# Altium schematic sheet MCU.SchDoc
size A3; SheetNumber: 2; SheetTotal: 3
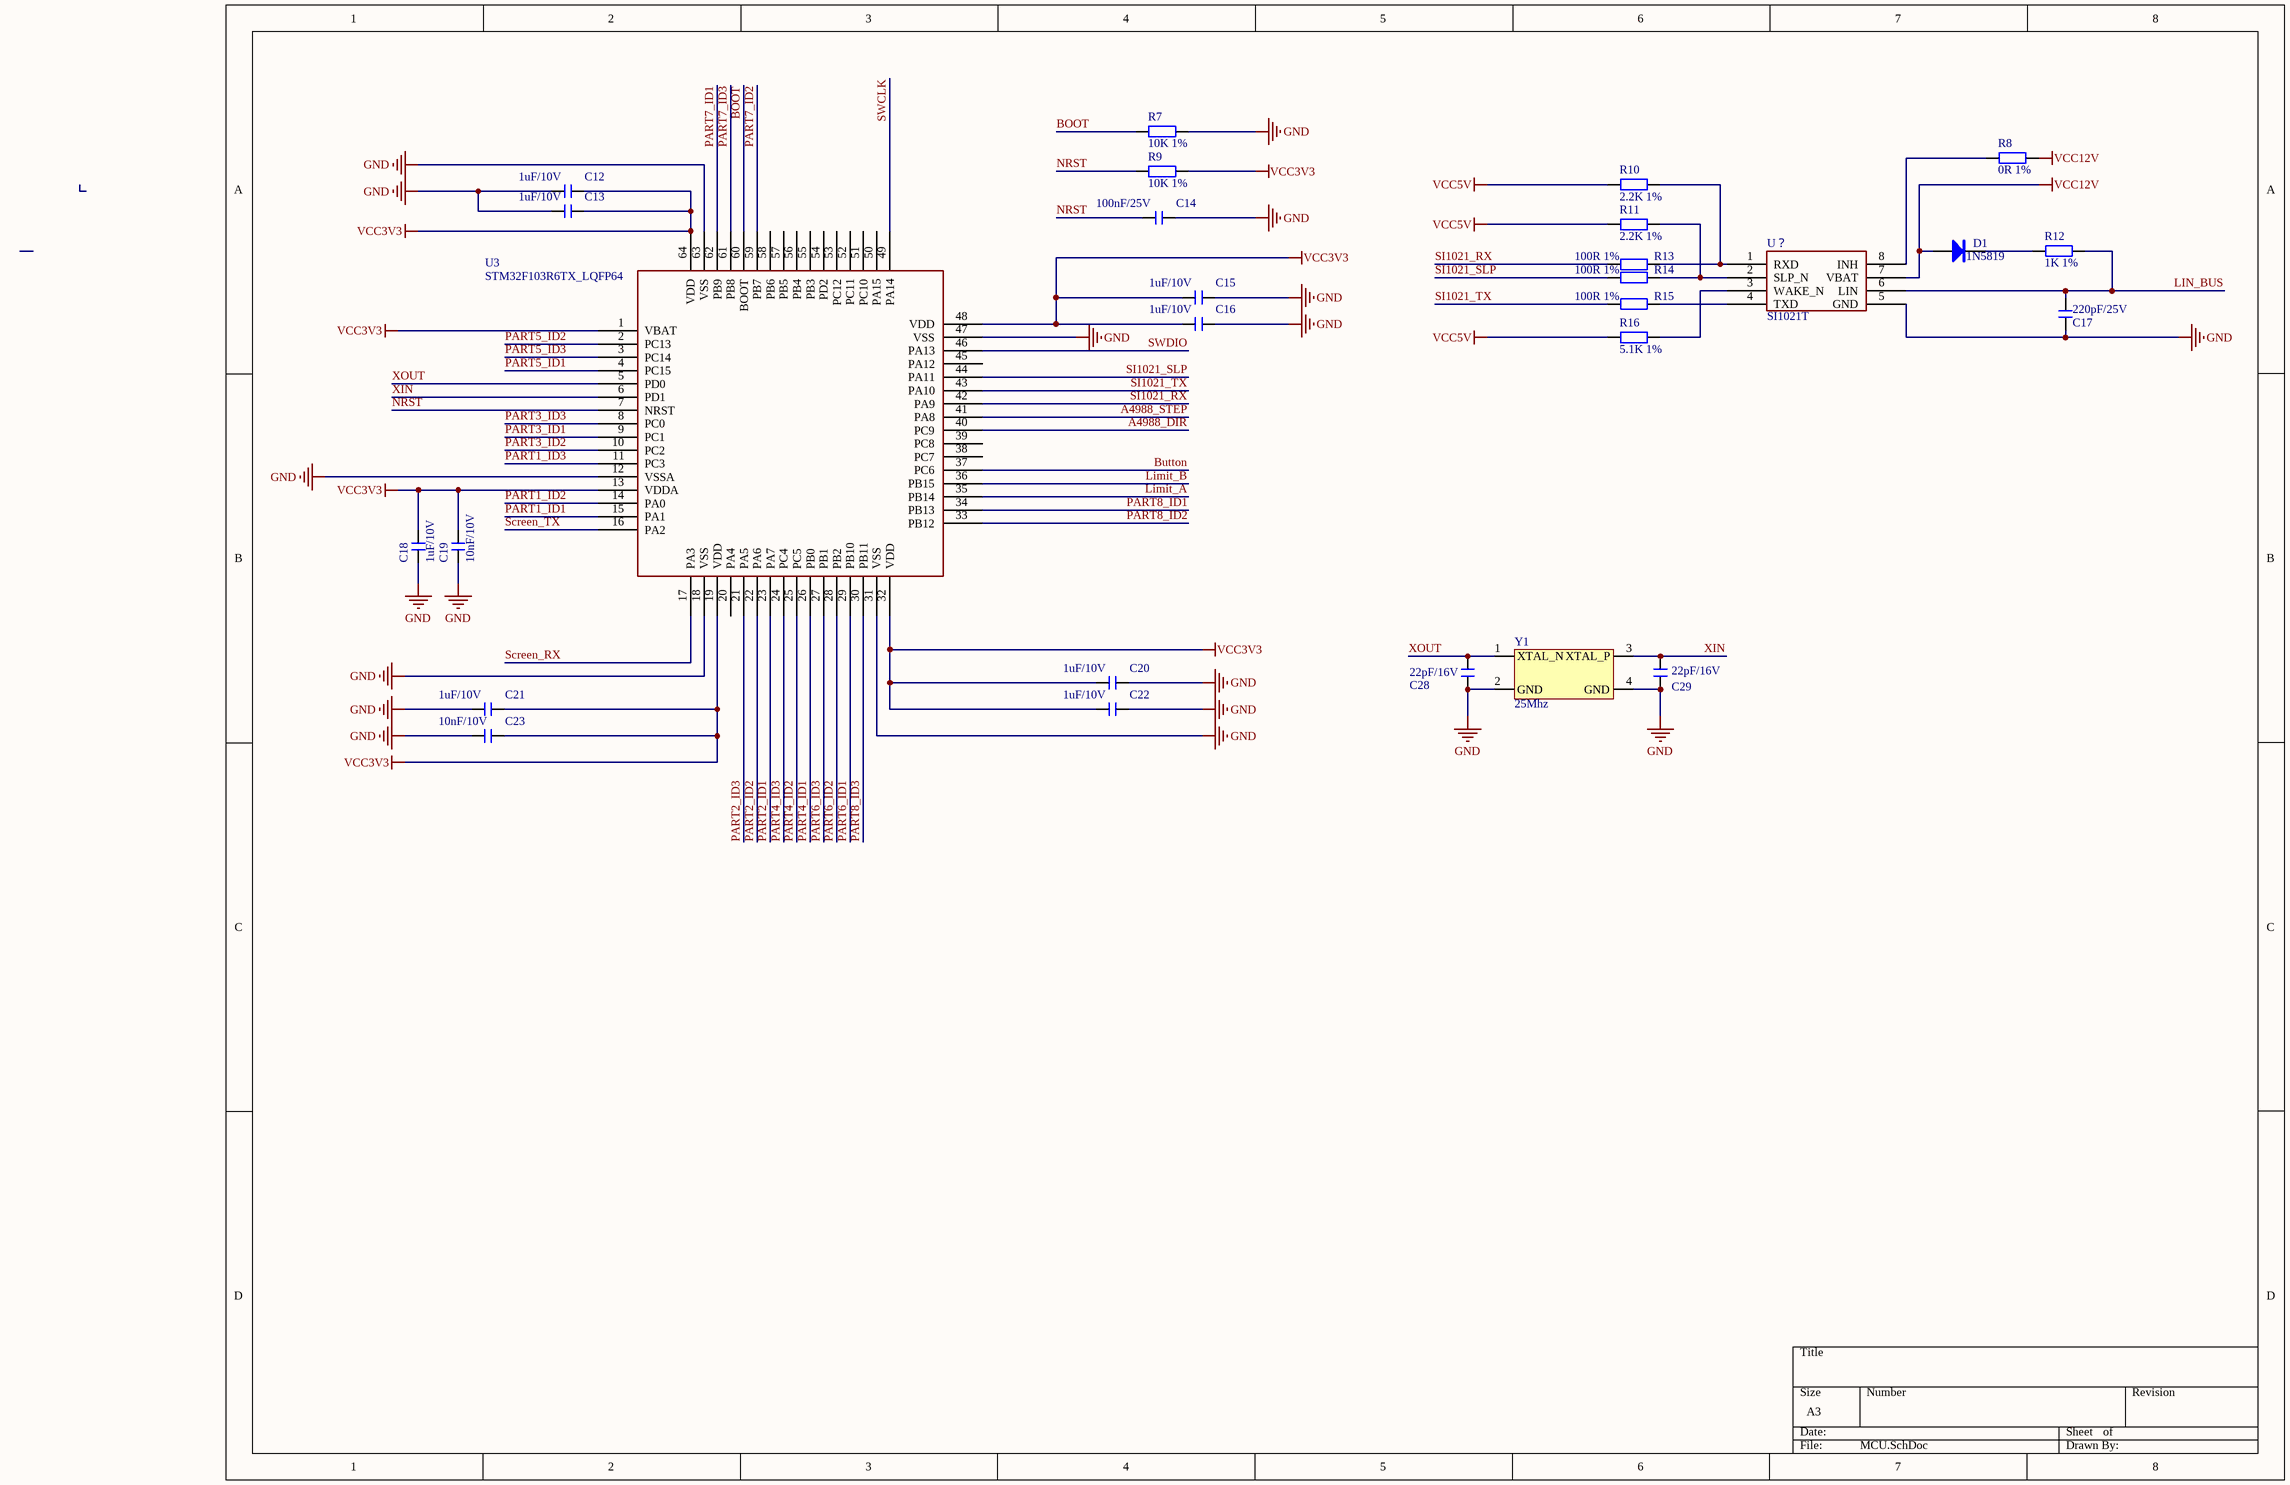
[diagram p0: MCU.SchDoc]

## Parts
C12  1uF/10V  [C0603_L]
C13  1uF/10V  [C0603_L]
C14  100nF/25V  [C0603_L]
C15  1uF/10V  [C0603_L]
C16  1uF/10V  [C0603_L]
C17  220pF/25V  [C0603_L]
C18  1uF/10V  [C0603_L]
C19  10nF/10V  [C0603_L]
C20  1uF/10V  [C0603_L]
C21  1uF/10V  [C0603_L]
C22  1uF/10V  [C0603_L]
C23  10nF/10V  [C0603_L]
C28  22pF/16V  [C0402_L]
C29  22pF/16V  [C0402_L]
D1  1N5819  [SOD-323]
R7  10K 1%  [R0603_L]
R8  0R 1%  [R0603_L]
R9  10K 1%  [R0603_L]
R10  2.2K 1%  [R0603_L]
R11  2.2K 1%  [R0603_L]
R12  1K 1%  [R0603_L]
R13  100R 1%  [R0603_L]
R14  100R 1%  [R0603_L]
R15  100R 1%  [R0603_L]
R16  5.1K 1%  [R0603_L]
U3  STM32F103R6TX_LQFP64  [LQFP64 10x10_N]
U？  SI1021T  [SOP8]
Y1  25Mhz  [OSC 3225-4P]

## Nets
GND: C12.2 C13.2 C14.1 C15.1 C16.1 C17.1 C18.1 C19.1 C20.1 C21.2 C22.1 C23.2 C28.2 C29.2 R7.2 U3.12(VSSA) U3.18(VSS) U3.31(VSS) U3.47(VSS) U3.63(VSS) U？.5(GND) Y1.2(GND) Y1.4(GND)
VCC3V3: C12.1 C13.1 C15.2 C16.2 C18.2 C19.2 C20.2 C21.1 C22.2 C23.1 R9.2 U3.1(VBAT) U3.13(VDDA) U3.19(VDD) U3.32(VDD) U3.48(VDD) U3.64(VDD)
VCC5V: R10.2 R11.2 R16.2
VCC12V: D1.1(A) R8.1 U？.7(VBAT)
A4988_DIR: U3.40(PC9)
A4988_STEP: U3.41(PA8)
BOOT: R7.1 U3.60(BOOT)
Button: U3.37(PC6)
Limit_A: U3.35(PB14)
Limit_B: U3.36(PB15)
LIN_BUS: C17.2 R12.1 U？.6(LIN)
NRST: C14.2 R9.1 U3.7(NRST)
PART1_ID1: U3.15(PA1)
PART1_ID2: U3.14(PA0)
PART1_ID3: U3.11(PC3)
PART2_ID1: U3.23(PA7)
PART2_ID2: U3.22(PA6)
PART2_ID3: U3.21(PA5)
PART3_ID1: U3.9(PC1)
PART3_ID2: U3.10(PC2)
PART3_ID3: U3.8(PC0)
PART4_ID1: U3.26(PB0)
PART4_ID2: U3.25(PC5)
PART4_ID3: U3.24(PC4)
PART5_ID1: U3.4(PC15)
PART5_ID2: U3.2(PC13)
PART5_ID3: U3.3(PC14)
PART6_ID1: U3.29(PB10)
PART6_ID2: U3.28(PB2)
PART6_ID3: U3.27(PB1)
PART7_ID1: U3.62(PB9)
PART7_ID2: U3.59(PB7)
PART7_ID3: U3.61(PB8)
PART8_ID1: U3.34(PB13)
PART8_ID2: U3.33(PB12)
PART8_ID3: U3.30(PB11)
Screen_RX: U3.17(PA3)
Screen_TX: U3.16(PA2)
SI1021_RX: R13.1 U3.42(PA9)
SI1021_SLP: R14.1 U3.44(PA11)
SI1021_TX: R15.1 U3.43(PA10)
SWCLK: U3.49(PA14)
SWDIO: U3.46(PA13)
XIN: C29.1 U3.6(PD1) Y1.3(XTAL_P)
XOUT: C28.1 U3.5(PD0) Y1.1(XTAL_N)
NetD1_2: D1.2(K) R12.2
NetR8_2: R8.2 U？.8(INH)
NetR10_1: R10.1 R13.2 U？.1(RXD)
NetR11_1: R11.1 R14.2 U？.2(SLP_N)
NetR15_2: R15.2 U？.4(TXD)
NetR16_1: R16.1 U？.3(WAKE_N)

Not connected (* = marked no-connect by the designer): U3 20(PA4) 38(PC7) 39(PC8) 45(PA12) 50(PA15) 51(PC10) 52(PC11) 53(PC12) 54(PD2) 55(PB3) 56(PB4) 57(PB5) 58(PB6)

## Library data of the parts
C12-C23 C28 C29 = C: 无极性贴片电容; 版权归属: 源创客; 材质: X7R; BOM名称: 无极性贴片电容; 学习资源: www.ooocke.com
D1 = 1N5819: 肖特基二极管; 版权归属: 源创客; 属性: 40V/2A; BOM名称: 肖特基二极管; 学习资源: www.ooocke.com
R7-R16 = R: 贴片电阻; 版权归属: 源创客; BOM名称: 贴片电阻; 学习资源: www.ooocke.com
U？ = SI1021T: SI1021T LIN收发器
Y1 = Crystal